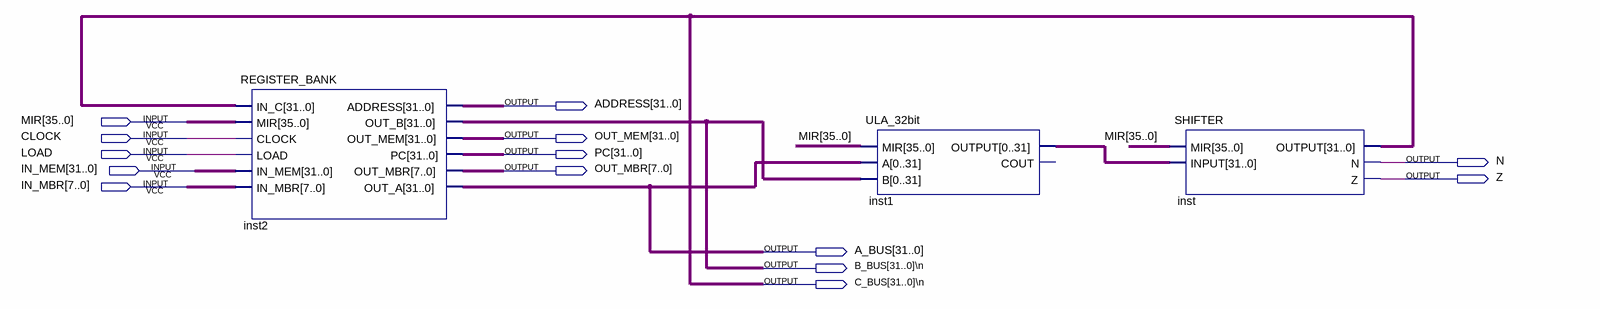
[diagram p0: schematic sheet]
// Quartus schematic DATA_PATH.bdf as structural Verilog: 3 symbols, 14 pins
module DATA_PATH (
  input  [35:0] MIR,
  input  CLOCK,
  input  LOAD,
  input  [31:0] IN_MEM,
  input  [7:0] IN_MBR,
  output [31:0] ADDRESS,
  output [31:0] OUT_MEM,
  output [31:0] PC,
  output N,
  output [7:0] OUT_MBR,
  output Z,
  output [31:0] A_BUS,
  output \B_BUS[31..0]\n ,
  output \C_BUS[31..0]\n 
);

  wire [31:0] inst1_output, inst2_out_b, inst_output;

  REGISTER_BANK inst2 (
    .IN_C(inst_output), .MIR(MIR), .CLOCK(CLOCK), .LOAD(LOAD), .IN_MEM(IN_MEM), .IN_MBR(IN_MBR),
    .ADDRESS(ADDRESS), .OUT_B(inst2_out_b), .OUT_MEM(OUT_MEM), .PC(PC), .OUT_MBR(OUT_MBR), .OUT_A(A_BUS));
  ULA_32bit inst1 (.MIR(MIR), .A(A_BUS), .B(inst2_out_b), .OUTPUT(inst1_output));  // open: COUT
  SHIFTER inst (.INPUT(inst1_output), .MIR(MIR), .OUTPUT(inst_output), .N(N), .Z(Z));
endmodule
